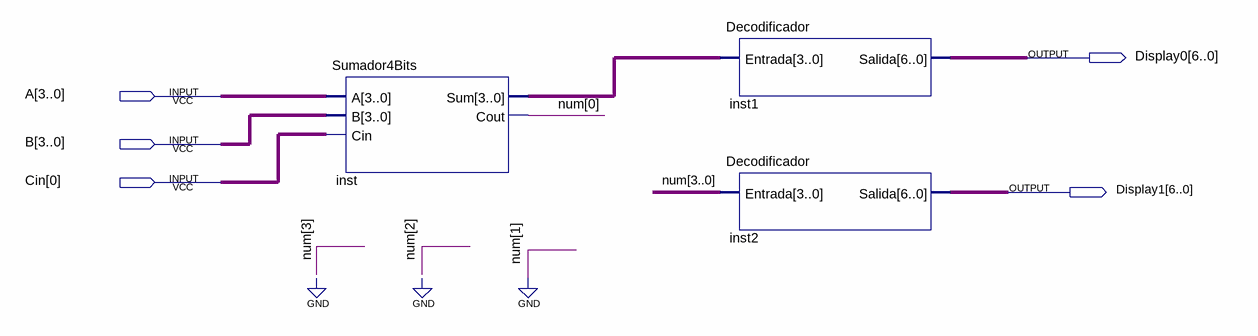
[diagram p0: schematic sheet]
// Quartus schematic SumadorCompleto.bdf as structural Verilog: 3 symbols, 5 pins
module SumadorCompleto (
  input  [3:0] A,
  input  [3:0] B,
  input  [0:0] Cin,
  output [6:0] Display0,
  output [6:0] Display1
);

  wire [3:0] inst_sum, num;

  Sumador4Bits inst (.A(A), .B(B), .Cin(Cin[0]), .Sum(inst_sum), .Cout(num[0]));
  Decodificador inst1 (.Entrada(inst_sum), .Salida(Display0));
  Decodificador inst2 (.Entrada({num[3:2], 1'b0, num[0]}), .Salida(Display1));
endmodule
